# Altium schematic sheet [06] - COMMUNICATION_INTERFACE.SchDoc
size A2; SheetNumber: 7; SheetTotal: 8
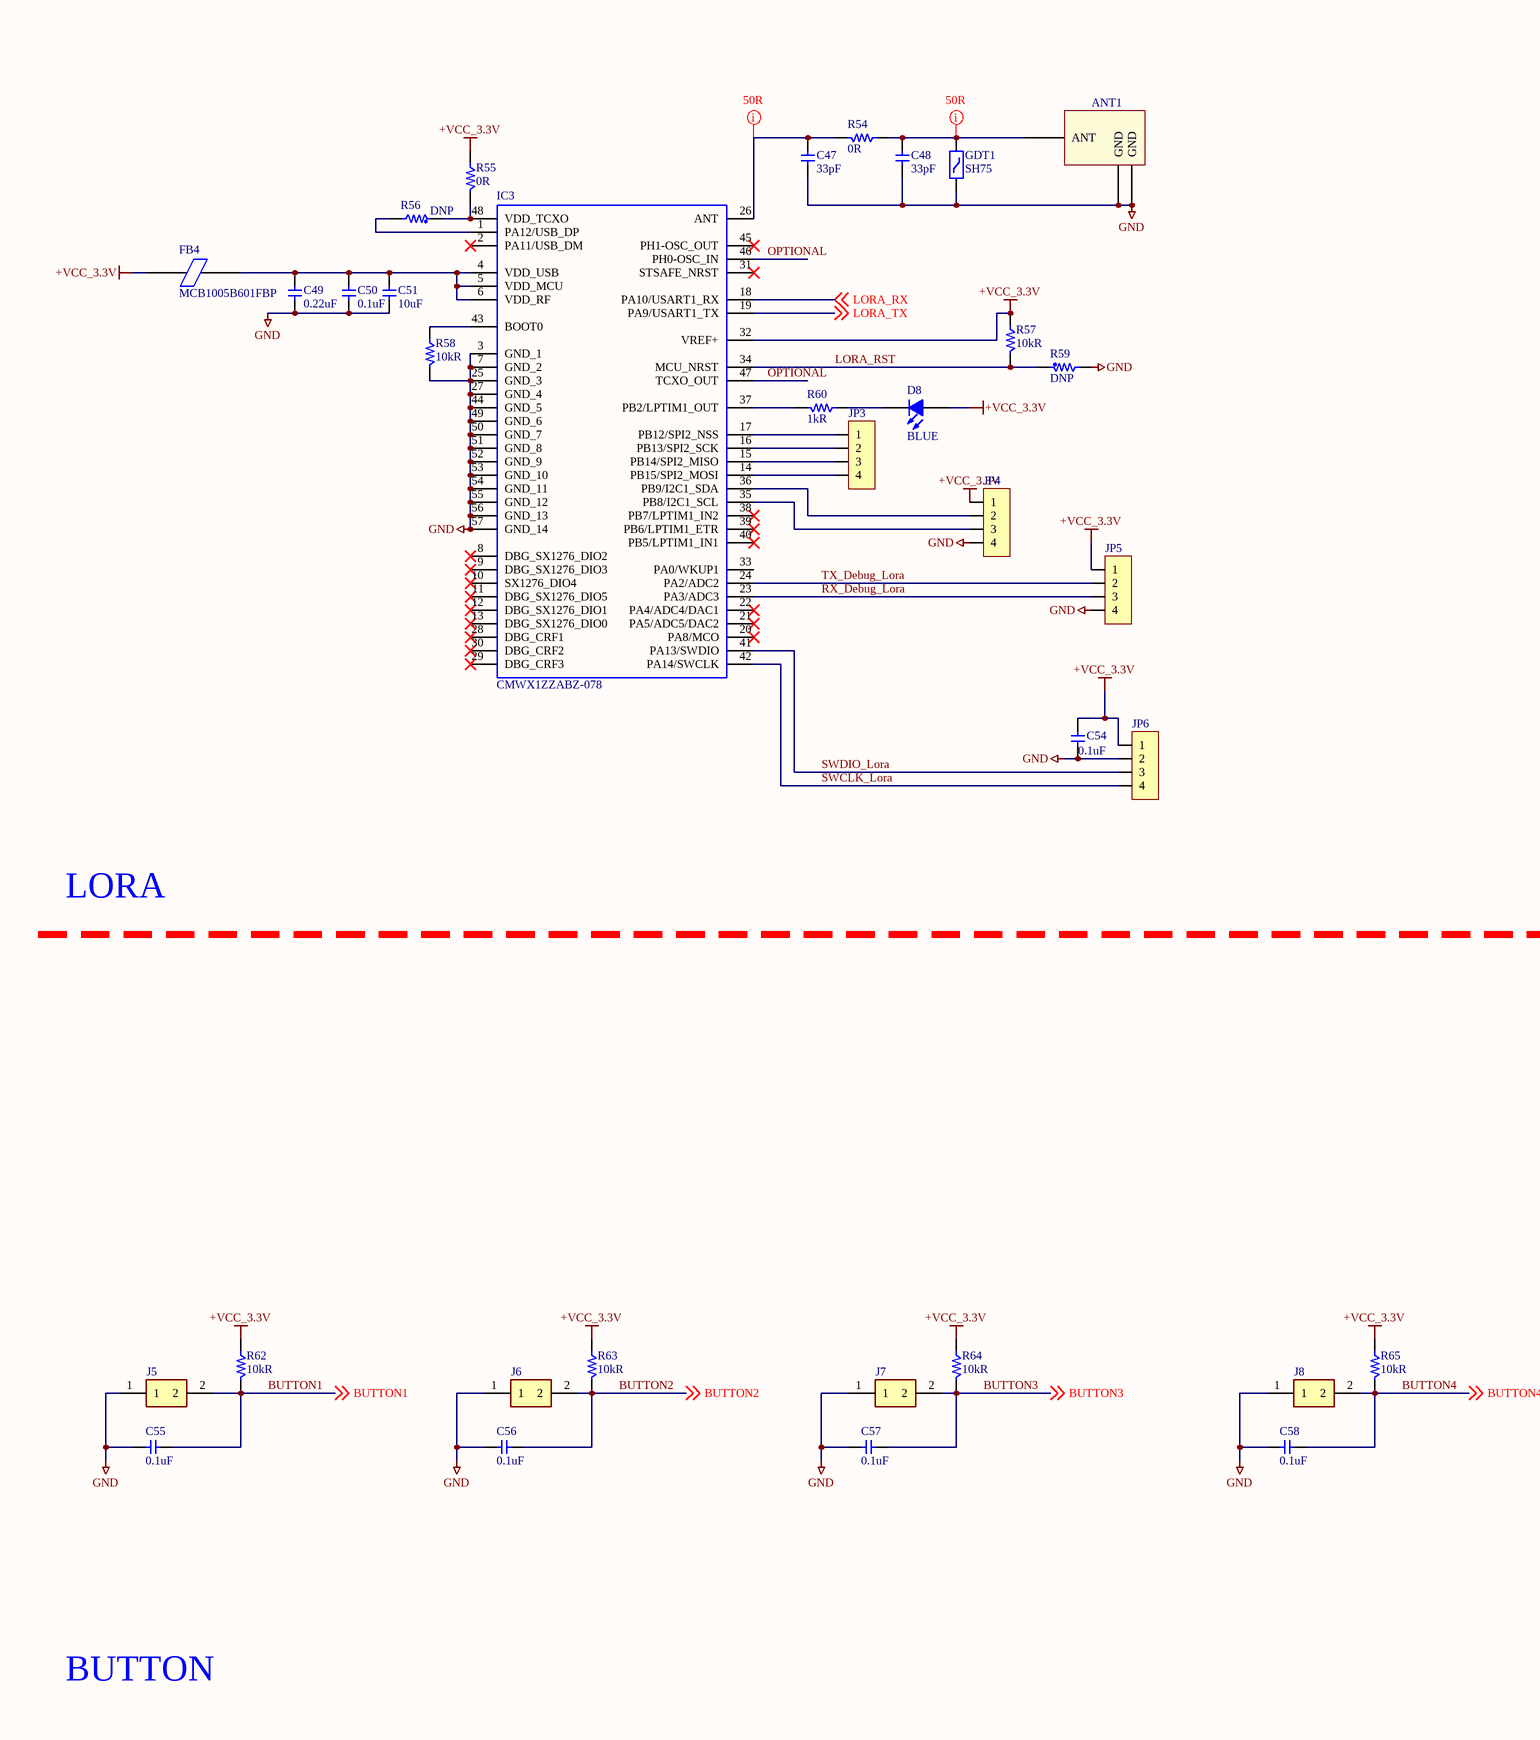
[diagram p0: [06] - COMMUNICATION_INTERFACE.SchDoc, left]
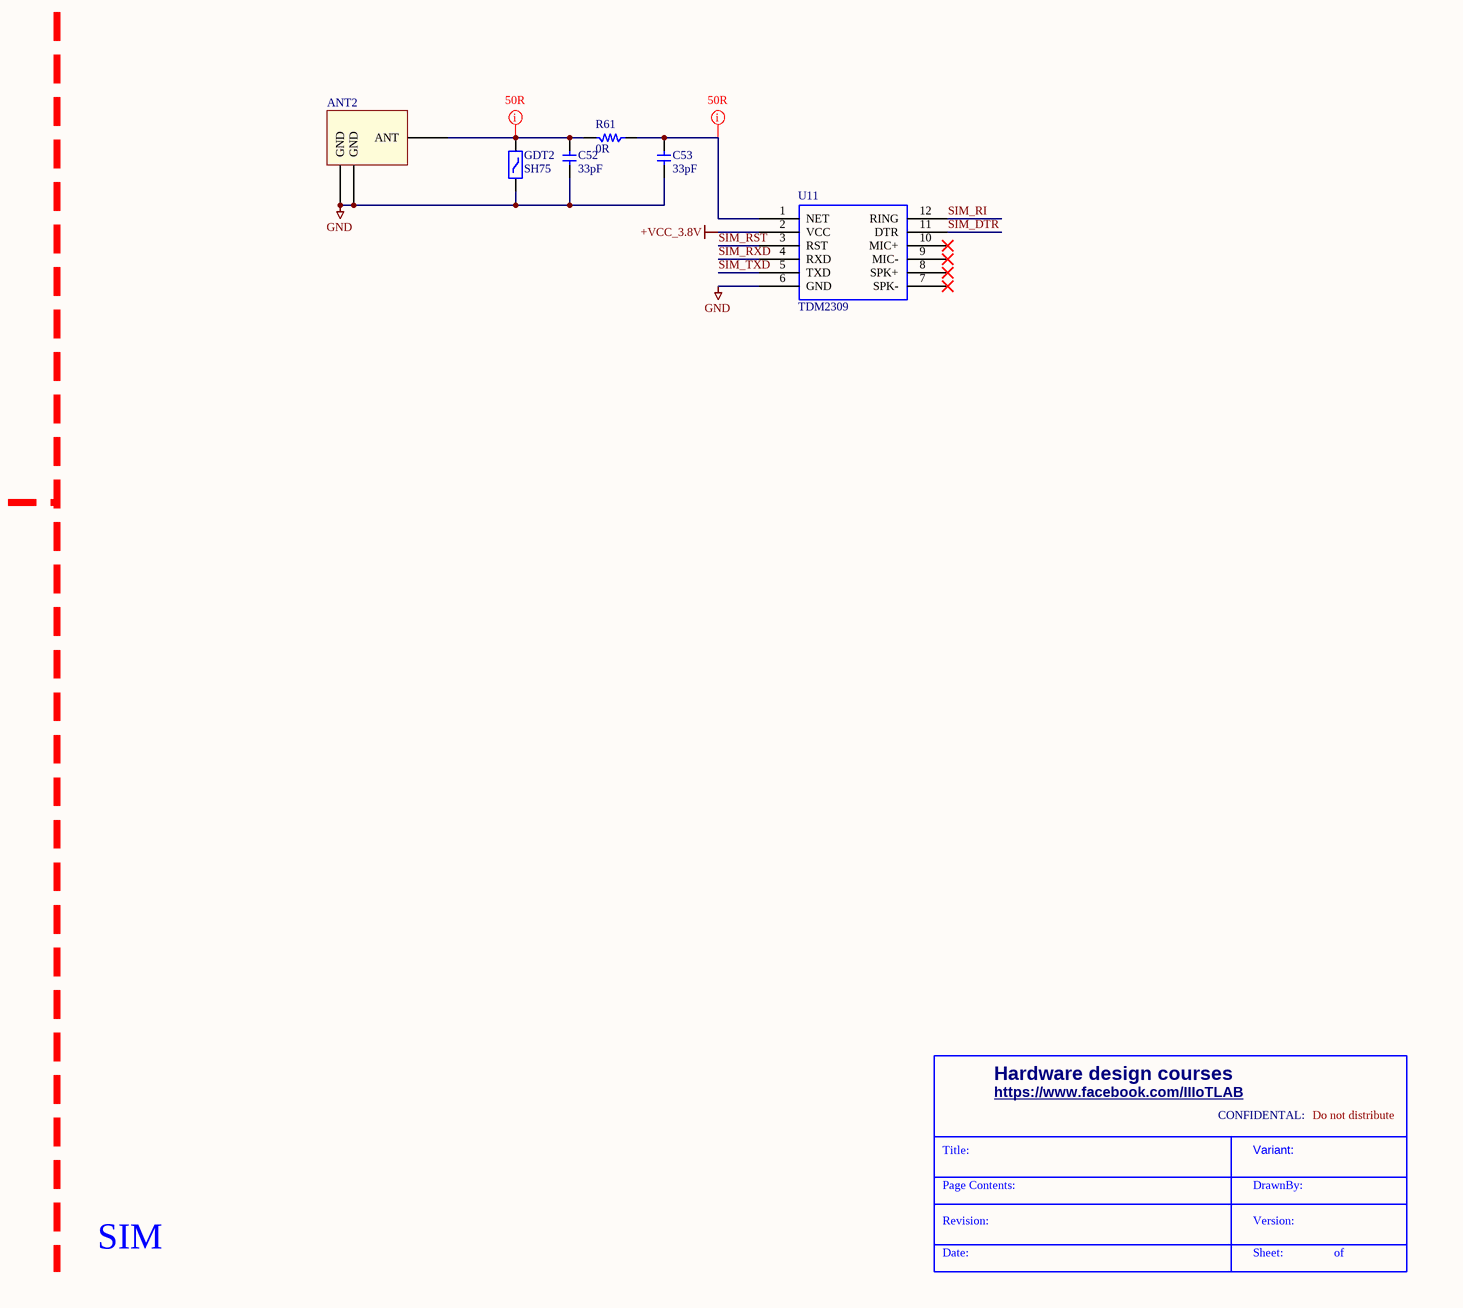
[diagram p1: [06] - COMMUNICATION_INTERFACE.SchDoc, right]

## Parts
ANT1  Anten SMD  [20279-001E-01]  (value not drawn)
ANT2  Anten SMD  [20279-001E-01]  (value not drawn)
C47  33pF  [CAP 0402 (1005)]
C48  33pF  [CAP 0402 (1005)]
C49  0.22uF  [CAP 0402 (1005)]
C50  0.1uF  [CAP 0402 (1005)]
C51  10uF  [CAP 0603 (1608)]
C52  33pF  [CAP 0402 (1005)]
C53  33pF  [CAP 0402 (1005)]
C54  0.1uF  [CAP 0402 (1005)]
C55  0.1uF  [CAP 0402 (1005)]
C56  0.1uF  [CAP 0402 (1005)]
C57  0.1uF  [CAP 0402 (1005)]
C58  0.1uF  [CAP 0402 (1005)]
D8  BLUE  [LED0402 BLUE]
FB4  MCB1005B601FBP  [FB 0402 (1005)]
GDT1  SH75  [GDT]
GDT2  SH75  [GDT]
IC3  CMWX1ZZABZ-078  [CMWX1ZZABZ-078]
J5  B2B-XH-2__LF__SN_  [B2BXH2LFSN]  (value not drawn)
J6  B2B-XH-2__LF__SN_  [B2BXH2LFSN]  (value not drawn)
J7  B2B-XH-2__LF__SN_  [B2BXH2LFSN]  (value not drawn)
J8  B2B-XH-2__LF__SN_  [B2BXH2LFSN]  (value not drawn)
JP3  JP 1x4 2.54  [JP 1x4 DT]  (value not drawn)
JP4  JP 1x4 2.54  [JP 1x4 DT]  (value not drawn)
JP5  JP 1x4 2.54  [JP 1x4 DT]  (value not drawn)
JP6  JP 1x4 2.54  [JP 1x4 DT]  (value not drawn)
R54  0R  [RES 0603 (1608)]
R55  0R  [RES 0603 (1608)]
R56  DNP  [RES 0603 (1608)]
R57  10kR  [RES 0402 (1005)]
R58  10kR  [RES 0402 (1005)]
R59  DNP  [RES 0402 (1005)]
R60  1kR  [RES 0402 (1005)]
R61  0R  [RES 0603 (1608)]
R62  10kR  [RES 0402 (1005)]
R63  10kR  [RES 0402 (1005)]
R64  10kR  [RES 0402 (1005)]
R65  10kR  [RES 0402 (1005)]
U11  TDM2309  [MODULE SIM SIM800L]

## Nets
+VCC_3.3V: C54.1 D8.1(A) FB4.1 IC3.32(VREF+) JP4.1 JP5.1 JP6.1 R55.2 R57.2 R62.2 R63.2 R64.2 R65.2
+VCC_3.8V: U11.2(VCC)
GND: ANT1.1(GND) ANT1.3(GND) ANT2.1(GND) ANT2.3(GND) C47.2 C48.2 C49.2 C50.2 C51.2 C52.2 C53.2 C54.2 C55.2 C56.2 C57.2 C58.2 GDT1.1 GDT2.1 IC3.3(GND_1) IC3.7(GND_2) IC3.25(GND_3) IC3.27(GND_4) IC3.44(GND_5) IC3.49(GND_6) IC3.50(GND_7) IC3.51(GND_8) IC3.52(GND_9) IC3.53(GND_10) IC3.54(GND_11) IC3.55(GND_12) IC3.56(GND_13) IC3.57(GND_14) J5.1 J6.1 J7.1 J8.1 JP4.4 JP5.4 JP6.2 R58.1 R59.2 U11.6(GND)
BUTTON1: C55.1 J5.2 R62.1 ; off-sheet BUTTON1
BUTTON2: C56.1 J6.2 R63.1 ; off-sheet BUTTON2
BUTTON3: C57.1 J7.2 R64.1 ; off-sheet BUTTON3
BUTTON4: C58.1 J8.2 R65.1 ; off-sheet BUTTON4
LORA_RST: IC3.34(MCU_NRST) R57.1 R59.1
LORA_RX: IC3.18(PA10/USART1_RX) ; off-sheet LORA_RX
LORA_TX: IC3.19(PA9/USART1_TX) ; off-sheet LORA_TX
OPTIONAL: IC3.46(PH0-OSC_IN) IC3.47(TCXO_OUT)
RX_Debug_Lora: IC3.23(PA3/ADC3) JP5.3
SIM_DTR: U11.11(DTR)
SIM_RI: U11.12(RING)
SIM_RST: U11.3(RST)
SIM_RXD: U11.4(RXD)
SIM_TXD: U11.5(TXD)
SWCLK_Lora: IC3.42(PA14/SWCLK) JP6.4
SWDIO_Lora: IC3.41(PA13/SWDIO) JP6.3
TX_Debug_Lora: IC3.24(PA2/ADC2) JP5.2
NetANT1_2: ANT1.2(ANT) C48.1 GDT1.2 R54.2
NetANT2_2: ANT2.2(ANT) C52.1 GDT2.2 R61.1
NetC47_1: C47.1 IC3.26(ANT) R54.1
NetC49_1: C49.1 C50.1 C51.1 FB4.2 IC3.4(VDD_USB) IC3.5(VDD_MCU) IC3.6(VDD_RF)
NetC53_1: C53.1 R61.2 U11.1(NET)
NetD8_2: D8.2(K) R60.2
NetIC3_1: IC3.1(PA12/USB_DP) R56.2
NetIC3_14: IC3.14(PB15/SPI2_MOSI) JP3.4
NetIC3_15: IC3.15(PB14/SPI2_MISO) JP3.3
NetIC3_16: IC3.16(PB13/SPI2_SCK) JP3.2
NetIC3_17: IC3.17(PB12/SPI2_NSS) JP3.1
NetIC3_35: IC3.35(PB8/I2C1_SCL) JP4.3
NetIC3_36: IC3.36(PB9/I2C1_SDA) JP4.2
NetIC3_37: IC3.37(PB2/LPTIM1_OUT) R60.1
NetIC3_43: IC3.43(BOOT0) R58.2
NetIC3_48: IC3.48(VDD_TCXO) R55.1 R56.1

Not connected (* = marked no-connect by the designer): IC3 2(PA11/USB_DM)* 8(DBG_SX1276_DIO2)* 9(DBG_SX1276_DIO3)* 10(SX1276_DIO4)* 11(DBG_SX1276_DIO5)* 12(DBG_SX1276_DIO1)* 13(DBG_SX1276_DIO0)* 20(PA8/MCO)* 21(PA5/ADC5/DAC2)* 22(PA4/ADC4/DAC1)* 28(DBG_CRF1)* 29(DBG_CRF3)* 30(DBG_CRF2)* 31(STSAFE_NRST)* 33(PA0/WKUP1) 38(PB7/LPTIM1_IN2)* 39(PB6/LPTIM1_ETR)* 40(PB5/LPTIM1_IN1)* 45(PH1-OSC_OUT)*; U11 7(SPK-)* 8(SPK+)* 9(MIC-)* 10(MIC+)*

## Layout directives
mark named 50R: NetANT1_2, NetANT2_2, NetC47_1, NetC53_1

## Notes on the sheet
- LORA
- Hardware design courses
- https://www.facebook.com/IIIoTLAB
- CONFIDENTAL:
- Do not distribute
- Title:
- Page Contents:
- Variant:
- DrawnBy:
- BUTTON
- SIM
- Revision:
- Date:
- Sheet:
- Version:
- of

## Library data of the parts
ANT1 ANT2 = Antenna SMD
C47 C48 C52 C53 = CAP0402 33pF 50V: 50V 33pF NP0 ±5% 0402 Multilayer Ceramic Capacitors MLCC - SMD/SMT ROHS; Manufacturer: YAGEO; Manufacturer Part Number: CC0402JRNPO9BN330; Supplier: LCSC electronics; Unit Price: $0.001
C49 = CAP0402 0.22uF 35V: 35V 0.22uF X5R ±10% 0402 Multilayer Ceramic Capacitors MLCC - SMD/SMT ROHS; Manufacturer: Murata Electronics; Manufacturer Part Number: GRT155R6YA224KE01D; Supplier: LCSC electronics; Unit Price: US$ 0.0130
C50 C54-C58 = CAP0402 0.1uF 50V: 50V 100nF ±10% 0402 Multilayer Ceramic Capacitors MLCC - SMD/SMT ROHS; Manufacturer: Samwha Capacitor; Manufacturer Part Number: CS1005X7R104K500NR; Supplier: LCSC electronics; Unit Price: $0.0017
C51 = CAP0603 10uF 25V: 25V 10uF X5R ±20% 0603 Multilayer Ceramic Capacitors MLCC - SMD/SMT ROHS; Manufacturer: Chinocera; Manufacturer Part Number: HGC0603R5106M250NTHJ; Supplier: LCSC electronics; Unit Price: $0.0199
D8 = LED BLUE 0402: blue 0402 Light Emitting Diodes (LED) ROHS; Manufacturer: BrtLed(Bright LED Elec); Manufacturer Part Number: BL-HB337A-AV-TRB; Supplier: LCSD electronics; Unit Price: $0.0178
FB4 = MCB1005B601FBP: 600mΩ ±25% 600Ω@100MHz 0402 Ferrite Beads ROHS; Manufacturer: INPAQ; Manufacturer Part Number: MCB1005B601FBP; Supplier: LCSD electronics; Unit Price: $0.0023
GDT1 GDT2 = GDT 75V 5KA 2 POLE SURFACE MOUNT: Gas Discharge Tube 75 V 5000A (5kA) 2 Pole Surface Mount; Manufacturer: Littelfuse; Manufacturer Part Number: SH75; Supplier: Digikey; Unit Price: $1.61
IC3 = CMWX1ZZABZ-078: Integrated Circuit; Manufacturer_Name: Murata Electronics; Datasheet Link: http://www.mouser.com/ds/2/281/Murata_11172016_CMWX1ZZABZ-078-1063304.pdf; Manufacturer_Part_Number: CMWX1ZZABZ-078; Mouser Part Number: 81-CMWX1ZZABZ-078; Mouser Price/Stock: https://www.mouser.co.uk/ProductDetail/Murata-Electronics/CMWX1ZZABZ-078?qs=POvGejmMzm8lN1bzM2%2FdRQ%3D%3D; Arrow Part Number: CMWX1ZZABZ-078; Arrow Price/Stock: https://www.arrow.com/en/products/cmwx1zzabz-078/murata-manufacturing
J5-J8 = B2B-XH-2__LF__SN_: Connector; Manufacturer_Name: JST (JAPAN SOLDERLESS TERMINALS); Manufacturer_Part_Number: B2B-XH-2 (LF)(SN); Datasheet Link: http://uk.rs-online.com/web/p/products/1755297; Height: 7mm; Arrow Part Number: B2B-XH-2 (LF)(SN); Arrow Price/Stock: https://www.arrow.com/en/products/b2b-xh-2-lf-sn/jst-manufacturing?region=europe
JP3-JP6 = JP 1x4 2.54 Duc Thang: Cắm; Ten_Linh_Kien: Jump Đơn Đực 2.54MM 1x40P Thẳng 11MM; Don_Vi: Con; Ma_Hang: MH000903; Ghi_Chu: *; Kieu_Chan: *; Chung_Loai: Cắm
R54 R55 R61 = RES0603 0R: 0Ω 0603 Chip Resistor - Surface Mount ROHS; Manufacturer: KOA Speer Elec; Manufacturer Part Number: RK73Z1JTTD; Supplier: LCSC electronics; Unit Price: $0.0048
R56 = RES0603 DNP: Res do not populate
R57 R58 R62-R65 = RES0402 10kR 1%: ±1% 10kΩ 0402 Chip Resistor - Surface Mount ROHS; Manufacturer: VO; Manufacturer Part Number: SCR0402F10K; Supplier: LCSC electronics; Unit Price: $0.0005
R59 = RES0402 DNP: Res do not populate
R60 = RES0402 1kR 1%: ±5% 1kΩ 0402 Chip Resistor - Surface Mount ROHS; Manufacturer: VO; Manufacturer Part Number: SCR0402J1K; Supplier: LCSC electronics; Unit Price: $0.0004
U11 = SIM TDM2309: Module 4G SIMCOM A7680C TDM2309; Manufacturer: SIMCOM; Manufacturer Part Number: TDM2309; Supplier: https://linhkienthuduc.com/; Unit Price: 189.000VND